# Altium schematic sheet northside.schdoc: North Side Connector
size 431 x 279 mm; DrawnBy: D. Bruey, M.Ciuffo; Organization: Synapse Product Development, LLC.; Address1: 1511 6th Ave., Suite 400; Address2: Seattle, Washington 98101; Address3: 206.381.0898; Address4: www.synapse.com; DocumentNumber: 9; SheetNumber: 8; SheetTotal: 10; PageSetup: Record=PageOptions|CenterHorizontal=True|CenterVertical=True|PrintScale=1.06|XCorrection=1.00|YCorrection=1.00|PrintKind=1|BorderSize=5000000|LeftOffset=0|BottomOffset=0|Orientation=2|PaperLength=4318|PaperWidth=2794|Scale=100|PaperSource=7|PrintQuality=200|MediaType=1|DitherType=10|PrintScaleMode=1|PaperKind=11x17|PaperIndex=3
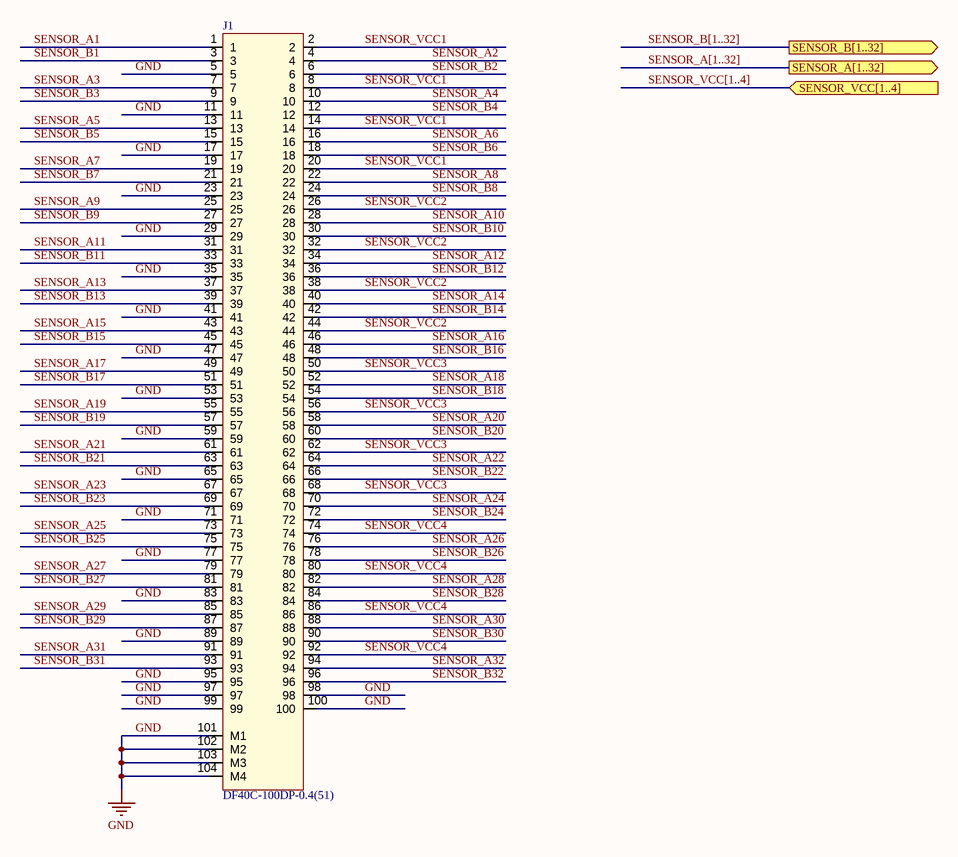
[diagram p0: northside.schdoc]

## Parts
J1  DF40C-100DP-0.4(51)  [con100_hirose-df40c-100dp_129h]

## Ports
SENSOR_A[1..32] (out), SENSOR_B[1..32] (out), SENSOR_VCC[1..4] (in)

## Nets
GND: J1.5 J1.11 J1.17 J1.23 J1.29 J1.35 J1.41 J1.47 J1.53 J1.59 J1.65 J1.71 J1.77 J1.83 J1.89 J1.95 J1.97 J1.98 J1.99 J1.100 J1.101(M1) J1.102(M2) J1.103(M3) J1.104(M4)
SENSOR_A1: J1.1
SENSOR_A2: J1.4
SENSOR_A3: J1.7
SENSOR_A4: J1.10
SENSOR_A5: J1.13
SENSOR_A6: J1.16
SENSOR_A7: J1.19
SENSOR_A8: J1.22
SENSOR_A9: J1.25
SENSOR_A10: J1.28
SENSOR_A11: J1.31
SENSOR_A12: J1.34
SENSOR_A13: J1.37
SENSOR_A14: J1.40
SENSOR_A15: J1.43
SENSOR_A16: J1.46
SENSOR_A17: J1.49
SENSOR_A18: J1.52
SENSOR_A19: J1.55
SENSOR_A20: J1.58
SENSOR_A21: J1.61
SENSOR_A22: J1.64
SENSOR_A23: J1.67
SENSOR_A24: J1.70
SENSOR_A25: J1.73
SENSOR_A26: J1.76
SENSOR_A27: J1.79
SENSOR_A28: J1.82
SENSOR_A29: J1.85
SENSOR_A30: J1.88
SENSOR_A31: J1.91
SENSOR_A32: J1.94
SENSOR_B1: J1.3
SENSOR_B2: J1.6
SENSOR_B3: J1.9
SENSOR_B4: J1.12
SENSOR_B5: J1.15
SENSOR_B6: J1.18
SENSOR_B7: J1.21
SENSOR_B8: J1.24
SENSOR_B9: J1.27
SENSOR_B10: J1.30
SENSOR_B11: J1.33
SENSOR_B12: J1.36
SENSOR_B13: J1.39
SENSOR_B14: J1.42
SENSOR_B15: J1.45
SENSOR_B16: J1.48
SENSOR_B17: J1.51
SENSOR_B18: J1.54
SENSOR_B19: J1.57
SENSOR_B20: J1.60
SENSOR_B21: J1.63
SENSOR_B22: J1.66
SENSOR_B23: J1.69
SENSOR_B24: J1.72
SENSOR_B25: J1.75
SENSOR_B26: J1.78
SENSOR_B27: J1.81
SENSOR_B28: J1.84
SENSOR_B29: J1.87
SENSOR_B30: J1.90
SENSOR_B31: J1.93
SENSOR_B32: J1.96
SENSOR_VCC1: J1.2 J1.8 J1.14 J1.20
SENSOR_VCC2: J1.26 J1.32 J1.38 J1.44
SENSOR_VCC3: J1.50 J1.56 J1.62 J1.68
SENSOR_VCC4: J1.74 J1.80 J1.86 J1.92

## Buses and harness runs
bus SENSOR_A[1..32] = port SENSOR_A[1..32]
bus SENSOR_B[1..32] = port SENSOR_B[1..32]
bus SENSOR_VCC[1..4] = port SENSOR_VCC[1..4]

## Notes on the sheet
- Design Notes:
- Layout Notes:
- Project:
- Sheet Title:
- PCBA:
- PROPRIETARY AND CONFIDENTIAL
- Drawn by:
- Schematic Part Number:
- Schematic Revision:
- Date:
- Sheet:
- /

## Library data of the parts
J1 = DF40C-100DP-0.4(51): CONN HDR 100POS 0.4MM SMD GOLD; part_type: connector; id: 1582; mfg: Hirose; dist: Digikey; dist_pn: H11614CT-ND; symbol: \\synapsedev.com\dfs\FS\EE_STUFF\CAD_LIB\MASTER\MASTER_CON\DF40C-100DP-0.4(51); voltage: 30V; positions: 100; TableName: viewAltiumConnectors; mfg_pn: DF40C-100DP-0.4(51); allegro_footprint: con100_hirose-df40c-100dp_129h; source_package: DF40C-100DP-0.4(51); height: 1.14mm; status: Unknown; datasheet: http://www.hirose.co.jp/cataloge_hp/ed_DF40_20140305.pdf